# Altium schematic sheet MOTHERBOARD.SCHDOC: MOTHERBOARD
size A4; DocumentNumber: 2; Revision: 2.0; SheetNumber: 2; SheetTotal: 18
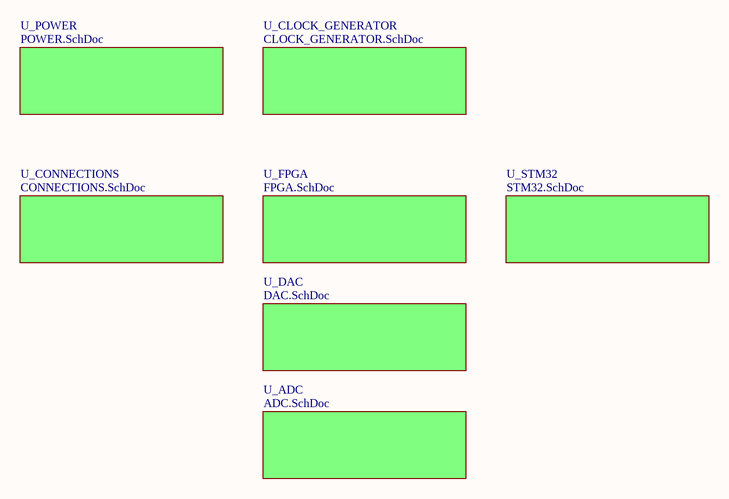
[diagram p0: MOTHERBOARD.SCHDOC]

## Sub-sheets
U_ADC = ADC.SchDoc: no entries
U_CLOCK_GENERATOR = CLOCK_GENERATOR.SchDoc: no entries
U_CONNECTIONS = CONNECTIONS.SchDoc: no entries
U_DAC = DAC.SchDoc: no entries
U_FPGA = FPGA.SchDoc: no entries
U_POWER = POWER.SchDoc: no entries
U_STM32 = STM32.SchDoc: no entries

## Notes on the sheet
- Title
- Size:
- Date:
- A4
- Number:
- Time:
- Revision:
- Sheet
- of
- File: